# EAGLE design B168X (EAGLE 6.6.0)
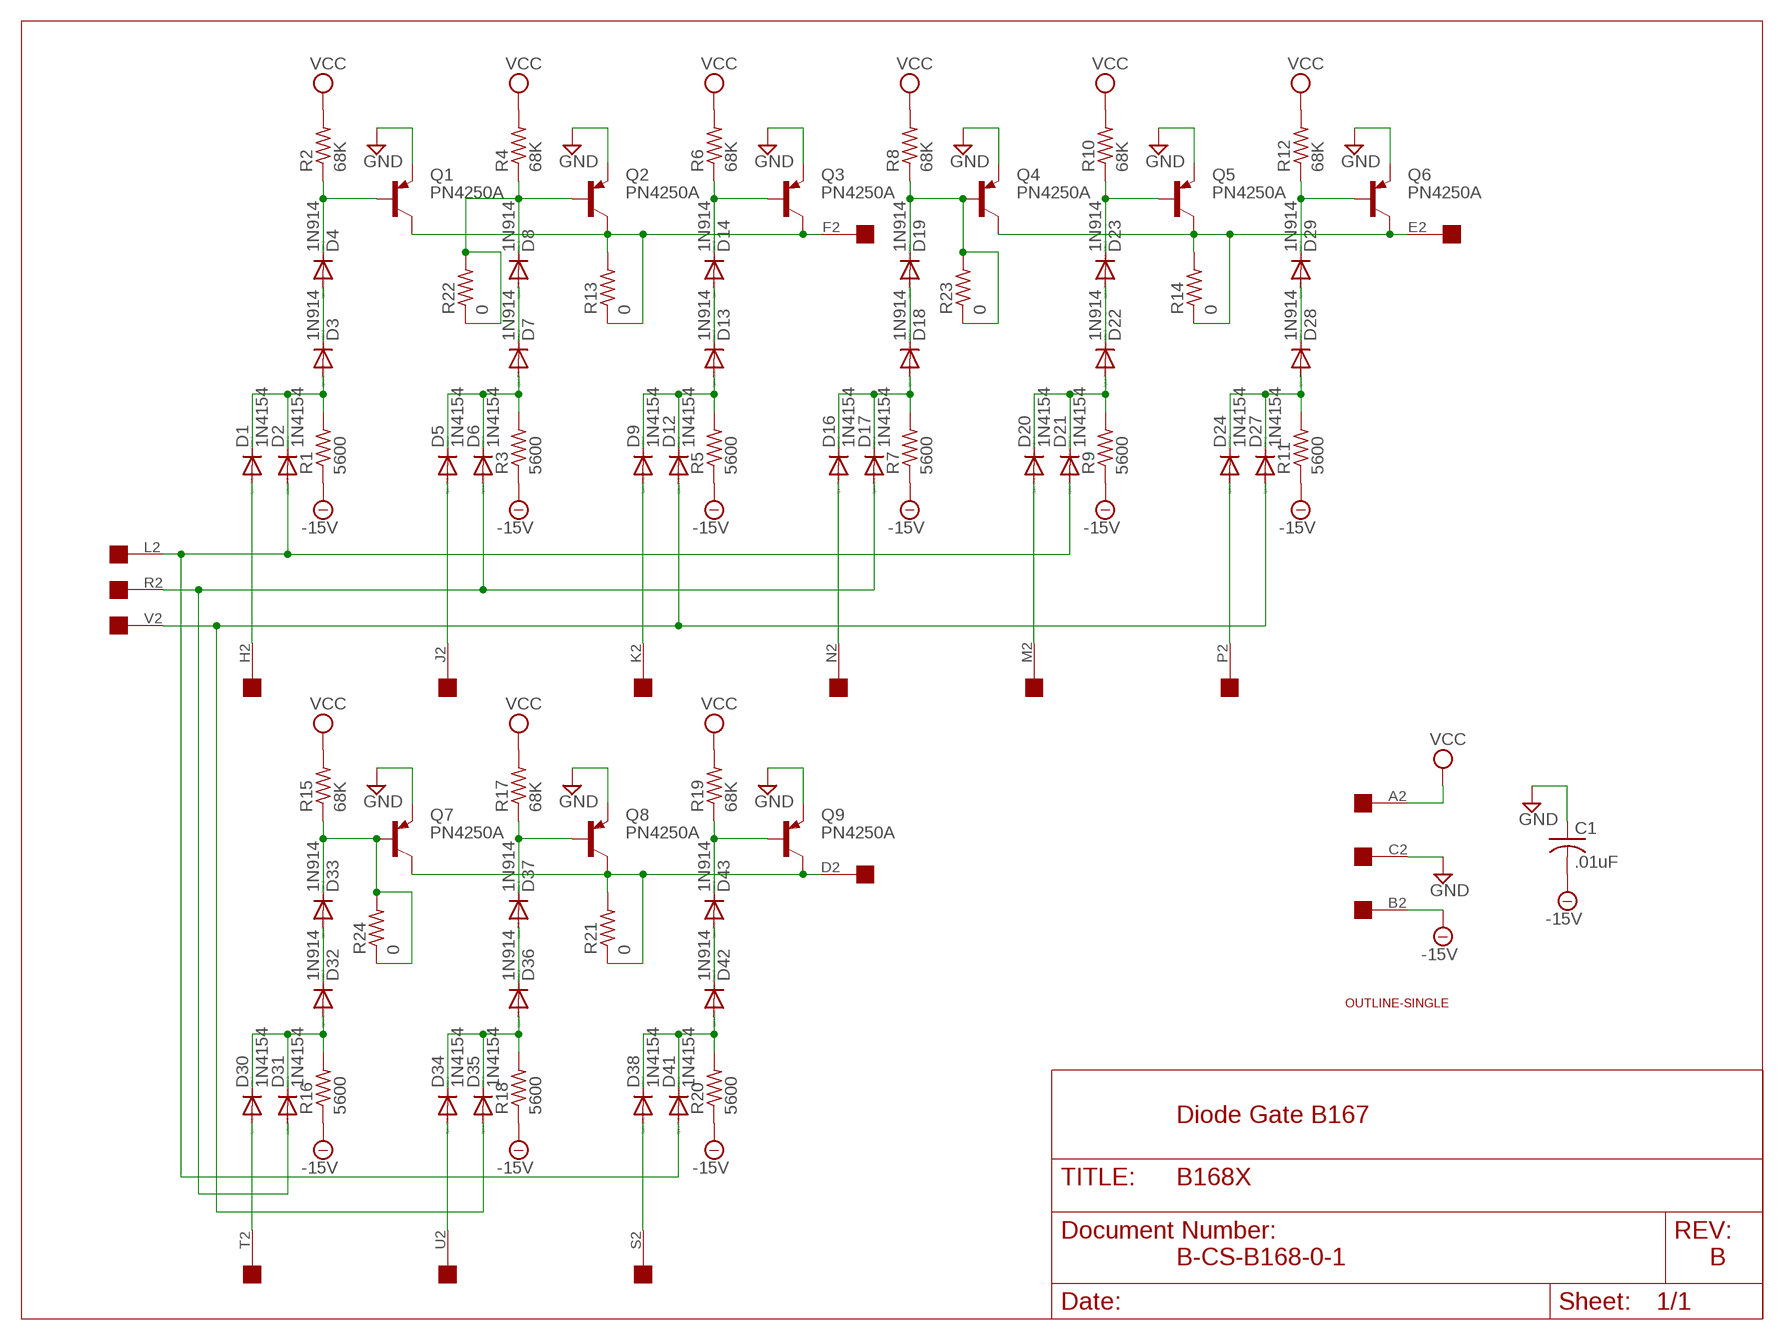
[diagram p0: schematic, sheet 1]

## Parts
C1  .01uF  C-US  [C063-025X075]
D1  1N4154  DIODE-DO35-10  [DO35-10]
D2  1N4154  DIODE-DO35-10  [DO35-10]
D3  1N914  DIODE-DO35-10  [DO35-10]
D4  1N914  DIODE-DO35-10  [DO35-10]
D5  1N4154  DIODE-DO35-10  [DO35-10]
D6  1N4154  DIODE-DO35-10  [DO35-10]
D7  1N914  DIODE-DO35-10  [DO35-10]
D8  1N914  DIODE-DO35-10  [DO35-10]
D9  1N4154  DIODE-DO35-10  [DO35-10]
D12  1N4154  DIODE-DO35-10  [DO35-10]
D13  1N914  DIODE-DO35-10  [DO35-10]
D14  1N914  DIODE-DO35-10  [DO35-10]
D16  1N4154  DIODE-DO35-10  [DO35-10]
D17  1N4154  DIODE-DO35-10  [DO35-10]
D18  1N914  DIODE-DO35-10  [DO35-10]
D19  1N914  DIODE-DO35-10  [DO35-10]
D20  1N4154  DIODE-DO35-10  [DO35-10]
D21  1N4154  DIODE-DO35-10  [DO35-10]
D22  1N914  DIODE-DO35-10  [DO35-10]
D23  1N914  DIODE-DO35-10  [DO35-10]
D24  1N4154  DIODE-DO35-10  [DO35-10]
D27  1N4154  DIODE-DO35-10  [DO35-10]
D28  1N914  DIODE-DO35-10  [DO35-10]
D29  1N914  DIODE-DO35-10  [DO35-10]
D30  1N4154  DIODE-DO35-10  [DO35-10]
D31  1N4154  DIODE-DO35-10  [DO35-10]
D32  1N914  DIODE-DO35-10  [DO35-10]
D33  1N914  DIODE-DO35-10  [DO35-10]
D34  1N4154  DIODE-DO35-10  [DO35-10]
D35  1N4154  DIODE-DO35-10  [DO35-10]
D36  1N914  DIODE-DO35-10  [DO35-10]
D37  1N914  DIODE-DO35-10  [DO35-10]
D38  1N4154  DIODE-DO35-10  [DO35-10]
D41  1N4154  DIODE-DO35-10  [DO35-10]
D42  1N914  DIODE-DO35-10  [DO35-10]
D43  1N914  DIODE-DO35-10  [DO35-10]
Q1  PN4250A  -PNP-TO5  [TO5]
Q2  PN4250A  -PNP-TO5  [TO5]
Q3  PN4250A  -PNP-TO5  [TO5]
Q4  PN4250A  -PNP-TO5  [TO5]
Q5  PN4250A  -PNP-TO5  [TO5]
Q6  PN4250A  -PNP-TO5  [TO5]
Q7  PN4250A  -PNP-TO5  [TO5]
Q8  PN4250A  -PNP-TO5  [TO5]
Q9  PN4250A  -PNP-TO5  [TO5]
R1  5600  R-US_0207/10  [0207/10]
R2  68K  R-US_0207/10  [0207/10]
R3  5600  R-US_0207/10  [0207/10]
R4  68K  R-US_0207/10  [0207/10]
R5  5600  R-US_0207/10  [0207/10]
R6  68K  R-US_0207/10  [0207/10]
R7  5600  R-US_0207/10  [0207/10]
R8  68K  R-US_0207/10  [0207/10]
R9  5600  R-US_0207/10  [0207/10]
R10  68K  R-US_0207/10  [0207/10]
R11  5600  R-US_0207/10  [0207/10]
R12  68K  R-US_0207/10  [0207/10]
R13  0  R-US_0207/10  [0207/10]
R14  0  R-US_0207/10  [0207/10]
R15  68K  R-US_0207/10  [0207/10]
R16  5600  R-US_0207/10  [0207/10]
R17  68K  R-US_0207/10  [0207/10]
R18  5600  R-US_0207/10  [0207/10]
R19  68K  R-US_0207/10  [0207/10]
R20  5600  R-US_0207/10  [0207/10]
R21  0  R-US_0207/10  [0207/10]
R22  0  R-US_0207/10  [0207/10]
R23  0  R-US_0207/10  [0207/10]
R24  0  R-US_0207/10  [0207/10]
U$1  OUTLINE-SINGLE  [SINGLE]
U$2  EDGE-1  [EDGE-CON1]

## Nets
-15V: C1.2 R1.1 R3.1 R5.1 R7.1 R9.1 R11.1 R16.1 R18.1 R20.1 U$2.B2
GND: C1.1 Q1.1(E) Q2.1(E) Q3.1(E) Q4.1(E) Q5.1(E) Q6.1(E) Q7.1(E) Q8.1(E) Q9.1(E) U$2.C2
N$1: D4.C Q1.2(B) R2.1
N$2: D3.C D4.A
N$3: D1.C D2.C D3.A R1.2
N$4: D8.C Q2.2(B) R4.1 R22.1 R22.2
N$5: D7.C D8.A
N$6: D5.C D6.C D7.A R3.2
N$7: D5.A U$2.J2
N$8: D6.A D17.A D31.A U$2.R2
N$9: D14.C Q3.2(B) R6.1
N$10: D13.C D14.A
N$11: D9.C D12.C D13.A R5.2
N$12: D9.A U$2.K2
N$13: D12.A D27.A D35.A U$2.V2
N$14: Q1.3(C) Q2.3(C) Q3.3(C) R13.1 R13.2 U$2.F2
N$15: D19.C Q4.2(B) R8.1 R23.1 R23.2
N$16: D18.C D19.A
N$17: D16.C D17.C D18.A R7.2
N$18: D16.A U$2.N2
N$19: D33.C Q7.2(B) R15.1 R24.1 R24.2
N$20: D23.C Q5.2(B) R10.1
N$21: D22.C D23.A
N$22: D20.C D21.C D22.A R9.2
N$23: D20.A U$2.M2
N$24: D32.C D33.A
N$25: D29.C Q6.2(B) R12.1
N$26: D28.C D29.A
N$27: D24.C D27.C D28.A R11.2
N$28: D24.A U$2.P2
N$29: D30.C D31.C D32.A R16.2
N$30: Q4.3(C) Q5.3(C) Q6.3(C) R14.1 R14.2 U$2.E2
N$31: D30.A U$2.T2
N$32: D37.C Q8.2(B) R17.1
N$33: D36.C D37.A
N$34: D34.C D35.C D36.A R18.2
N$35: D1.A U$2.H2
N$36: D34.A U$2.U2
N$37: D43.C Q9.2(B) R19.1
N$38: D42.C D43.A
N$39: D38.C D41.C D42.A R20.2
N$40: D38.A U$2.S2
N$41: Q7.3(C) Q8.3(C) Q9.3(C) R21.1 R21.2 U$2.D2
N$42: D2.A D21.A D41.A U$2.L2
VCC: R2.2 R4.2 R6.2 R8.2 R10.2 R12.2 R15.2 R17.2 R19.2 U$2.A2

## Notes on the sheet
- Diode Gate B167
- B-CS-B168-0-1 | B

## Library data of the parts
C1 = dec-con:C-US: Capacitors with funky DEC lead spacing.
D1-D9 D12-D14 D16-D24 D27-D38 D41-D43 = diode:DIODE-: DIODE
Q1-Q9 = transistor:*-PNP-: PNP Transistror
R1-R24 = rcl:R-US_: RESISTOR, American symbol
U$1 = dec-con:OUTLINE-*: Board outlines for DEC boards.
U$2 = dec-con:EDGE-1: Single-Sided DEC Edge Connector -- (side 2)

## Board
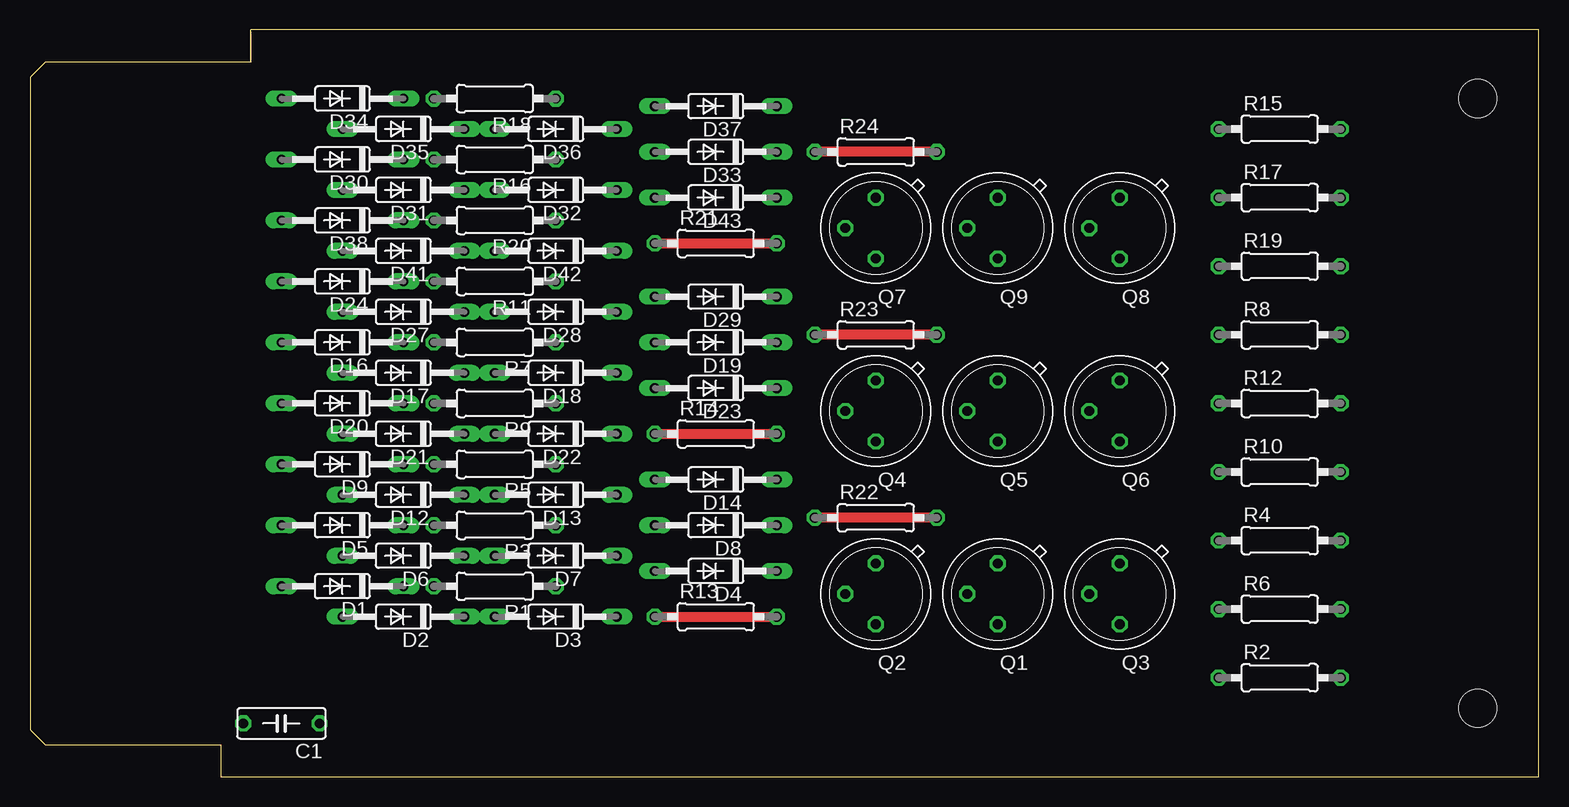
[diagram p1: board, top side]
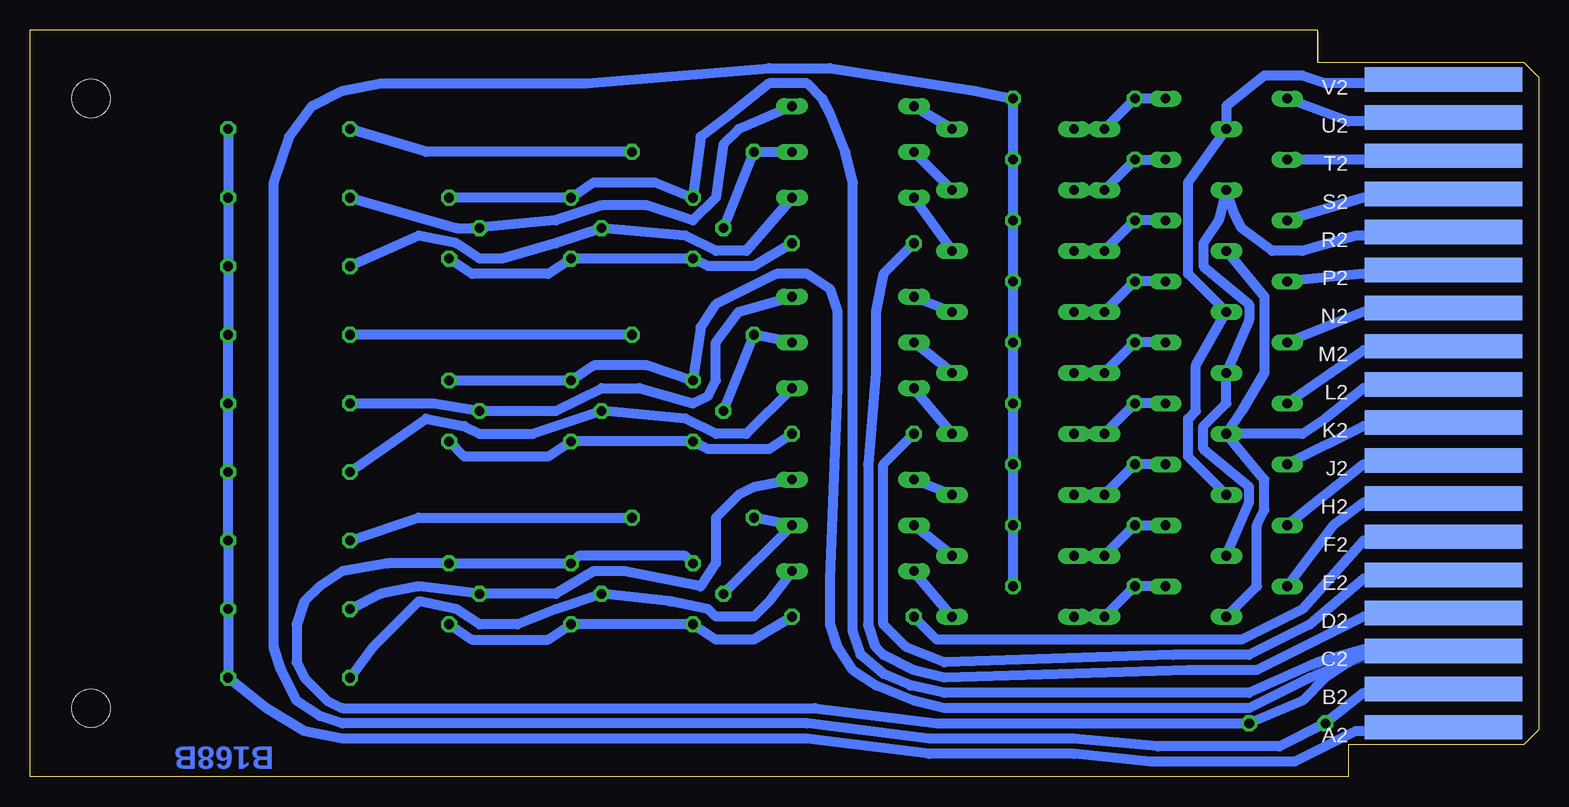
[diagram p2: board, bottom side, seen from below]

Size 125.73 x 62.23 mm. Coordinates in mm from the lower left corner, seen from the top.
Copper layers (1+16): Top 0.035mm / dielectric 1.5mm / Bottom 0.035mm
Design rules "16mils": minimum track width 16mil, minimum drill 32mil, track to track 15mil, track to pad 10mil, pad to pad 10mil, via to via 10mil, smd to smd 10mil, copper to edge 13mil, drill to drill 10mil, minimum pad ring 10mil, minimum via ring 8mil, stop-mask expansion 0mil, vias tented up to drill 0mil, thermal gap 10mil

### Footprints (pad centres in the part's own frame; a part is rotated, then mirrored left to right if it is on the bottom)
C063-025X075 = drill 0.813 octagon: 1 -2.54,0; 2 3.81,0
DO35-10 = drill 0.813 long: A 5.08,0; C -5.08,0
TO5 = drill 0.813 octagon: 1 0,-2.54; 2 2.54,0; 3 0,2.54
0207/10 = drill 0.813 octagon: 1 -5.08,0; 2 5.08,0
SINGLE = hole 3.175: 120.65,56.515; 120.65,5.715
EDGE-CON1 = smd 13.106 x 2.032 bottom: A2 7.938,4.128; B2 7.938,7.303; C2 7.938,10.477; D2 7.938,13.652; E2 7.938,16.828; F2 7.938,20.003; H2 7.938,23.177; J2 7.938,26.352; K2 7.938,29.527; L2 7.938,32.703; M2 7.938,35.877; N2 7.938,39.053; P2 7.938,42.227; R2 7.938,45.403; S2 7.938,48.578; T2 7.938,51.752; U2 7.938,54.928; V2 7.938,58.102

### Placement (x,y rotation side)
C1  21.59,4.45 180 top
D1  26.04,15.88 180 top
D2  31.12,13.34 180 top
D3  43.82,13.34 180 top
D4  57.15,17.14 180 top
D5  26.04,20.95 180 top
D6  31.12,18.41 180 top
D7  43.82,18.41 180 top
D8  57.15,20.95 180 top
D9  26.04,26.04 180 top
D12  31.12,23.5 180 top
D13  43.82,23.5 180 top
D14  57.15,24.77 180 top
D16  26.04,36.2 180 top
D17  31.12,33.66 180 top
D18  43.82,33.66 180 top
D19  57.15,36.2 180 top
D20  26.04,31.11 180 top
D21  31.12,28.57 180 top
D22  43.82,28.57 180 top
D23  57.15,32.38 180 top
D24  26.04,41.27 180 top
D27  31.12,38.73 180 top
D28  43.82,38.73 180 top
D29  57.15,40.01 180 top
D30  26.04,51.44 180 top
D31  31.12,48.9 180 top
D32  43.82,48.9 180 top
D33  57.15,52.07 180 top
D34  26.04,56.52 180 top
D35  31.12,53.98 180 top
D36  43.82,53.98 180 top
D37  57.15,55.88 180 top
D38  26.04,46.35 180 top
D41  31.12,43.81 180 top
D42  43.82,43.81 180 top
D43  57.15,48.26 180 top
Q1  80.65,15.24 180 top
Q2  70.49,15.24 180 top
Q3  90.81,15.24 180 top
Q4  70.49,30.48 180 top
Q5  80.65,30.48 180 top
Q6  90.81,30.48 180 top
Q7  70.49,45.72 180 top
Q8  90.81,45.72 180 top
Q9  80.65,45.72 180 top
R1  38.74,15.88 180 top
R2  104.14,8.26 0 top
R3  38.74,20.95 180 top
R4  104.14,19.68 0 top
R5  38.74,26.04 180 top
R6  104.14,13.97 0 top
R7  38.74,36.2 180 top
R8  104.14,36.83 0 top
R9  38.74,31.11 180 top
R10  104.14,25.4 0 top
R11  38.74,41.27 180 top
R12  104.14,31.11 0 top
R13  57.15,13.34 0 top
R14  57.15,28.57 0 top
R15  104.14,53.98 0 top
R16  38.74,51.44 180 top
R17  104.14,48.26 0 top
R18  38.74,56.52 180 top
R19  104.14,42.55 0 top
R20  38.74,46.35 180 top
R21  57.15,44.45 0 top
R22  70.49,21.59 0 top
R23  70.49,36.83 0 top
R24  70.49,52.07 0 top
U$1  0,0 0 top
U$2  0,0 0 top

### Tracks (layer width: path | path; a pad name or v marks a point on that pad's centre or on a via)
-15V
  Bottom 0.813: U$2.B2 8.89,6.99 14.61,6.99 C1.2 21.59,2.54 31.75,2.54 38.74,3.17 50.8,3.17 60.96,4.45 99.7,4.45 101.6,5.08 103.51,6.35 104.78,8.89 105.41,10.79 105.41,49.53 104.14,53.34 102.24,55.88 99.7,57.15 96.52,57.78 79.38,57.78 64.14,59.05 59.06,59.05 46.99,57.15 R18.1 R16.1 R20.1 R11.1 R7.1 R9.1 R5.1 R3.1 R1.1
GND
  Bottom 0.813: Q2.1 71.12,18.41 80.01,18.41 Q1.1 Q3.1 95.89,17.78 99.7,17.14 101.6,15.88 102.87,14.61 103.51,12.7 103.51,9.53 102.87,8.26 100.97,6.35 99.7,5.71 60.33,5.71 50.17,4.45 C1.1 19.69,6.35 17.78,8.26 15.88,9.53 | U$2.C2 8.89,10.16 13.97,10.16 | 13.97,10.16 14.61,10.16 15.88,9.53 | 15.88,9.53 19.05,8.26 24.13,5.71 49.53,5.71 52.07,6.35 55.25,7.62 57.15,8.89 58.42,10.79 59.06,12.7 59.06,16.51 58.42,32.38 58.42,38.73 59.06,40.64 60.96,41.91 63.5,41.91 68.58,39.37 69.85,37.47 Q4.1 74.3,34.29 78.74,34.29 Q5.1 Q6.1 | 13.97,10.16 13.97,10.79 18.42,9.53 24.13,6.99 49.53,6.99 52.39,7.62 54.61,8.57 56.52,10.16 57.15,12.06 57.15,49.53 57.79,52.07 59.06,55.24 59.69,56.52 60.96,57.78 64.14,57.78 67.31,55.24 69.85,53.34 Q7.1 73.66,49.53 78.74,49.53 Q9.1 Q8.1
  pour Bottom (no thermals): 13.97,10.79 13.97,10.16 15.88,9.53 17.78,8.26 18.42,7.62 18.42,9.53
N$1
  Bottom 0.813: D4.C 64.14,14.61 65.41,13.34 68.58,13.34 69.22,13.97 72.39,14.61 Q1.2 81.92,13.97 85.09,12.7 88.27,12.7 90.17,13.97 93.35,14.61 97.16,10.79 R2.1
N$2
  Bottom 0.813: D3.C D4.A
N$3
  Bottom 0.813: D1.C R1.2 D2.C D3.A
N$4
  Top 0.813: R22.2 R22.1
  Bottom 0.813: Q2.2 D8.C R22.1 | R4.1 93.35,21.59 R22.2
N$5
  Bottom 0.813: D7.C D8.A
N$6
  Bottom 0.813: D7.A D6.C R3.2 D5.C
N$7
  Bottom 0.813: U$2.J2 8.89,26.04 14.61,26.04 D5.A
N$8
  Bottom 0.813: U$2.R2 8.26,45.09 15.24,45.09 19.69,43.81 22.23,43.81 24.77,45.72 25.4,46.99 D31.A 26.67,46.35 27.94,44.45 27.94,42.55 24.13,39.37 24.13,38.1 D17.A 26.04,31.11 27.94,29.21 27.94,27.3 24.13,24.13 24.13,22.86 D6.A
N$9
  Bottom 0.813: D14.C 65.41,24.13 66.68,23.5 68.58,21.59 68.58,17.78 69.85,15.88 76.2,17.14 78.74,17.14 81.92,15.24 Q3.2 93.35,15.88 96.52,15.24 R6.1
N$10
  Bottom 0.813: D13.C D14.A
N$11
  Bottom 0.813: D9.C R5.2 D12.C D13.A
N$12
  Bottom 0.813: U$2.K2 8.89,29.21 14.61,29.21 D9.A
N$13
  Bottom 0.813: U$2.V2 8.89,57.78 17.78,57.78 19.69,58.42 22.86,58.42 26.04,55.88 D35.A 29.21,49.53 29.21,41.91 D27.A 28.58,34.29 28.58,30.48 29.21,29.84 29.21,26.67 D12.A
N$14
  Top 0.813: R13.1 R13.2
  Bottom 0.813: R13.2 65.41,11.43 68.58,11.43 Q2.3 Q1.3 82.55,11.43 88.9,11.43 Q3.3 | U$2.F2 8.89,19.68 14.61,19.68 19.69,13.97 24.77,11.43 50.17,11.43 R13.1
N$15
  Top 0.813: R23.2 R23.1
  Bottom 0.813: D19.C R23.1 Q4.2 | R23.2 R8.1
N$16
  Bottom 0.813: D18.C D19.A
N$17
  Bottom 0.813: D16.C R7.2 D17.C D18.A
N$18
  Bottom 0.813: U$2.N2 9.53,38.73 14.61,38.73 D16.A
N$19
  Top 0.813: R24.2 R24.1
  Bottom 0.813: D33.C R24.1 Q7.2 | R24.2 92.71,52.07 R15.1
N$20
  Bottom 0.813: R10.1 92.71,29.84 89.54,29.21 88.27,28.57 83.82,28.57 Q5.2 71.12,29.84 68.58,28.57 66.04,28.57 D23.C
N$21
  Bottom 0.813: D22.C D23.A
N$22
  Bottom 0.813: D20.C R9.2 D21.C D22.A
N$23
  Bottom 0.813: U$2.M2 8.89,35.56 14.61,35.56 D20.A
N$24
  Bottom 0.813: D33.A D32.C
N$25
  Bottom 0.813: R12.1 92.08,31.11 Q6.2 81.92,30.48 78.11,32.38 74.93,32.38 70.49,31.11 69.22,31.75 68.58,33.02 68.58,36.2 66.68,38.73 D29.C
N$26
  Bottom 0.813: D29.A D28.C
N$27
  Bottom 0.813: D24.C R11.2 D27.C D28.A
N$28
  Bottom 0.813: U$2.P2 8.89,41.91 14.61,41.91 D24.A
N$29
  Bottom 0.813: D30.C R16.2 D31.C D32.A
N$30
  Top 0.813: R14.1 R14.2
  Bottom 0.813: U$2.E2 8.89,16.51 14.61,16.51 19.05,12.7 24.13,10.16 30.48,10.16 49.53,9.53 52.71,10.79 54.61,12.7 54.61,26.04 R14.1 | Q6.3 89.54,26.67 82.55,26.67 Q5.3 Q4.3 69.22,27.3 64.14,27.3 R14.2
N$31
  Bottom 0.813: U$2.T2 8.26,51.44 D30.A
N$32
  Bottom 0.813: R17.1 90.17,45.72 88.9,45.72 | 88.9,45.72 Q8.2 | D37.C 66.68,53.98 67.95,52.7 68.58,48.26 70.49,46.35 74.3,47.62 78.11,47.62 81.92,46.35 88.9,45.72
N$33
  Bottom 0.813: D36.C D37.A
N$34
  Bottom 0.813: D34.C R18.2 D35.C D36.A
N$35
  Bottom 0.813: U$2.H2 8.89,22.86 14.61,22.86 17.15,20.95 D1.A
N$36
  Bottom 0.813: U$2.U2 8.89,54.61 15.88,54.61 D34.A
N$37
  Bottom 0.813: D43.C 66.04,43.81 68.58,43.81 71.12,45.09 Q9.2 81.92,44.45 86.36,43.18 88.27,43.18 90.17,44.45 93.35,45.09 R19.1
N$38
  Bottom 0.813: D43.A D42.C
N$39
  Bottom 0.813: D38.C R20.2 D41.C D42.A
N$40
  Bottom 0.813: U$2.S2 8.89,48.26 14.61,48.26 D38.A
N$41
  Top 0.813: R21.1 R21.2
  Bottom 0.813: R21.1 54.61,41.91 55.25,38.73 55.25,33.66 55.88,26.04 55.88,12.7 55.25,10.79 54.61,10.16 52.07,8.89 49.53,8.26 29.21,8.89 23.5,8.89 14.61,13.34 8.26,13.34 U$2.D2 | Q8.3 88.9,41.91 82.55,41.91 Q9.3 Q7.3 69.22,42.55 65.41,42.55 R21.2
N$42
  Bottom 0.813: D41.A 22.86,40.01 22.86,33.66 24.77,30.48 D21.A | D2.A 23.5,15.88 23.5,20.95 22.86,22.23 22.86,24.77 D21.A | U$2.L2 8.89,32.38 14.61,32.38 17.78,29.84 19.69,28.57 D21.A
VCC
  Bottom 0.813: U$2.A2 8.89,3.81 15.24,3.81 20.32,1.27 32.39,1.27 38.74,1.91 50.8,1.91 60.96,3.17 99.7,3.17 102.87,3.81 106.05,5.71 R2.2 R6.2 R4.2 R10.2 R12.2 R8.2 R19.2 R17.2 R15.2

### Text on the board
Bottom: B168B
200bmp: C:/Users/Vince/Documents/eagle/projects/DEC/Bxxx/B168/B168Bbackfb.bmp